# EAGLE design biSensors (EAGLE 5.11)
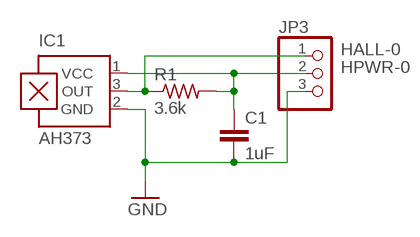
[diagram p0: schematic, sheet 1]

## Parts
C1  1uF  C-EUC1206  [C1206]
IC1  AH373  A1301UA  [SIP3-UA]
JP3  PINHD-1X3  [1X03]
R1  3.6k  R-US_R1206  [R1206]

## Nets
GND: C1.2 IC1.2(GND) JP3.3
HALL-0: IC1.3(OUT) JP3.1 R1.1
HPWR-0: C1.1 IC1.1(VCC) JP3.2 R1.2

## Library data of the parts
C1 = makani_rcl:C-EU: CAPACITOR, European symbol
IC1 = allegro:A13*?: Linear Hall Effect Sensor ICs Continuous-Time Ratiometric High-Temperature Operation Programmable Linear with Analog Output A1302 -Replacement- UGN3503 Source: http://www.allegromicro.com/en/Products/Part_Numbers/1301/1301.pdf http://www.allegromicro.com/en/Products/Part_Numbers/1321/1321.pdf http://www.allegromicro.com/en/Products/Part_Numbers/1381/1381.pdf
JP3 = pinhead:PINHD-1X3: PIN HEADER
R1 = rcl:R-US_: RESISTOR, American symbol

## Board
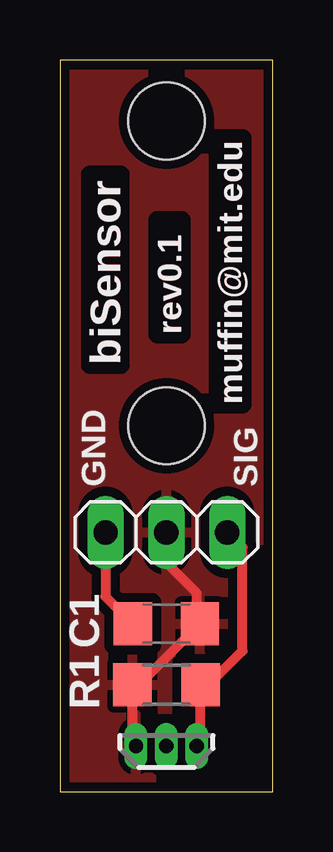
[diagram p1: board, top side]
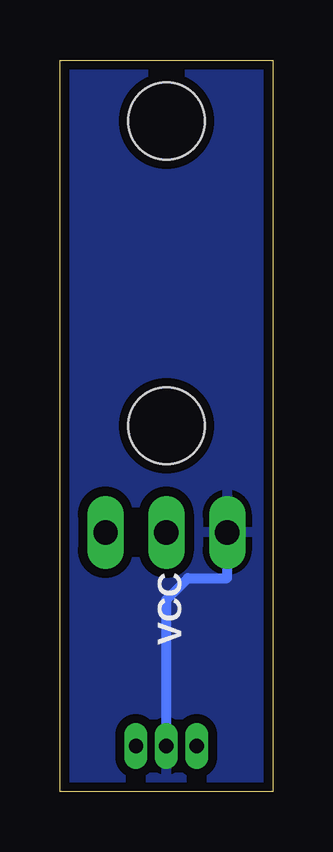
[diagram p2: board, bottom side, seen from below]

Size 8.89 x 30.48 mm. Coordinates in mm from the lower left corner, seen from the top.
Outline: 0,0 8.89,0 8.89,30.48 0,30.48 0,0
Copper layers (1*16): Top 0.0356mm / dielectric 1.5011mm / Bottom 0.0356mm
Design rules "LaenPCBOrder": minimum track width 6mil, minimum drill 13mil, track to track 6mil, track to pad 6mil, pad to pad 6mil, via to via 6mil, smd to smd 6mil, copper to edge 15mil, drill to drill 6mil, minimum pad ring 7mil, minimum via ring 7mil, stop-mask expansion 4mil, vias tented up to drill 0mil, thermal gap 10mil
Holes 3.2 mm at 4.45,15.24 4.45,27.94

### Footprints (pad centres in the part's own frame; a part is rotated, then mirrored left to right if it is on the bottom)
C1206 = smd 1.6 x 1.8: 1 -1.4,0; 2 1.4,0
SIP3-UA = drill 0.6 pad 0.7 long: 1 -1.27,0; 2 0,0; 3 1.27,0
1X03 = drill 1.016 long: 1 -2.54,0; 2 0,0; 3 2.54,0
R1206 = smd 1.6 x 1.803: 1 -1.422,0; 2 1.422,0

### Placement (x,y rotation side)
C1  4.45,6.99 180 top
IC1  4.45,1.91 0 top
JP3  4.45,10.79 180 top
R1  4.45,4.45 180 top

### Tracks (layer width: path | path; a pad name or v marks a point on that pad's centre or on a via)
GND
  Top 0.406: JP3.3 1.91,8.12 C1.2
  Bottom 0.406: IC1.2 4.45,7.99 3.55,8.89 1.91,8.89 JP3.3
  pour Bottom (isolate 0.381): 0,31.11 8.89,31.11 8.89,0 0,0
HALL-0
  Top 0.406: IC1.3 5.87,1.91 R1.1 6.2,4.45 7.62,5.87 7.62,10.16 JP3.1
HPWR-0
  Top 0.406: IC1.1 3.02,1.91 R1.2 3.31,4.45 C1.1 5.71,6.99 5.71,8.26 4.45,9.53 JP3.2
  pour Top (isolate 0.381): 0,31.11 0,0 8.89,0 8.89,31.11

### Text on the board
Top: rev0.1 | biSensor | muffin@mit.edu
tNames: rev0.1 | biSensor | muffin@mit.edu
_tsilk: GND | SIG
_bsilk: VCC